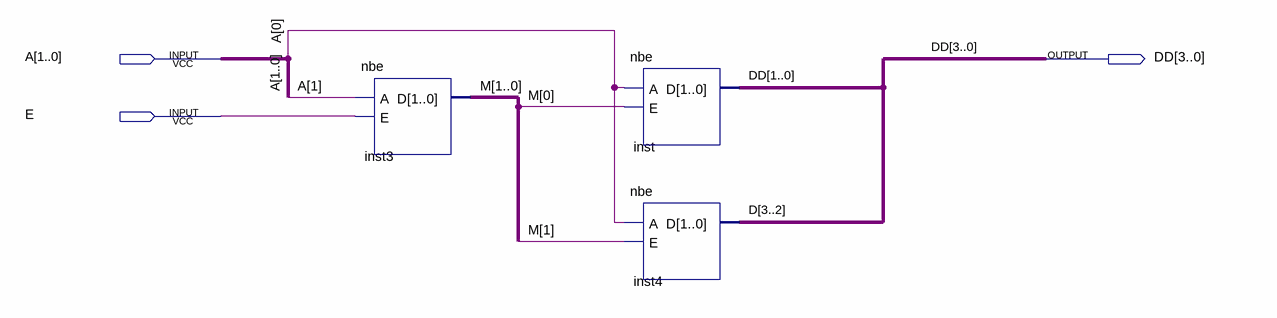
[diagram p0: schematic sheet]
// Quartus schematic decoder2_4_pro_max.bdf as structural Verilog: 3 symbols, 3 pins
module decoder2_4_pro_max (
  input  [1:0] A,
  input  E,
  output [3:0] DD
);

  wire [1:0] M;
  wire [3:2] D;

  nbe inst3 (.A(A[1]), .E(E), .D(M));
  nbe inst (.A(A[0]), .E(M[0]), .D(DD[1:0]));
  nbe inst4 (.A(A[0]), .E(M[1]), .D(D));
endmodule
